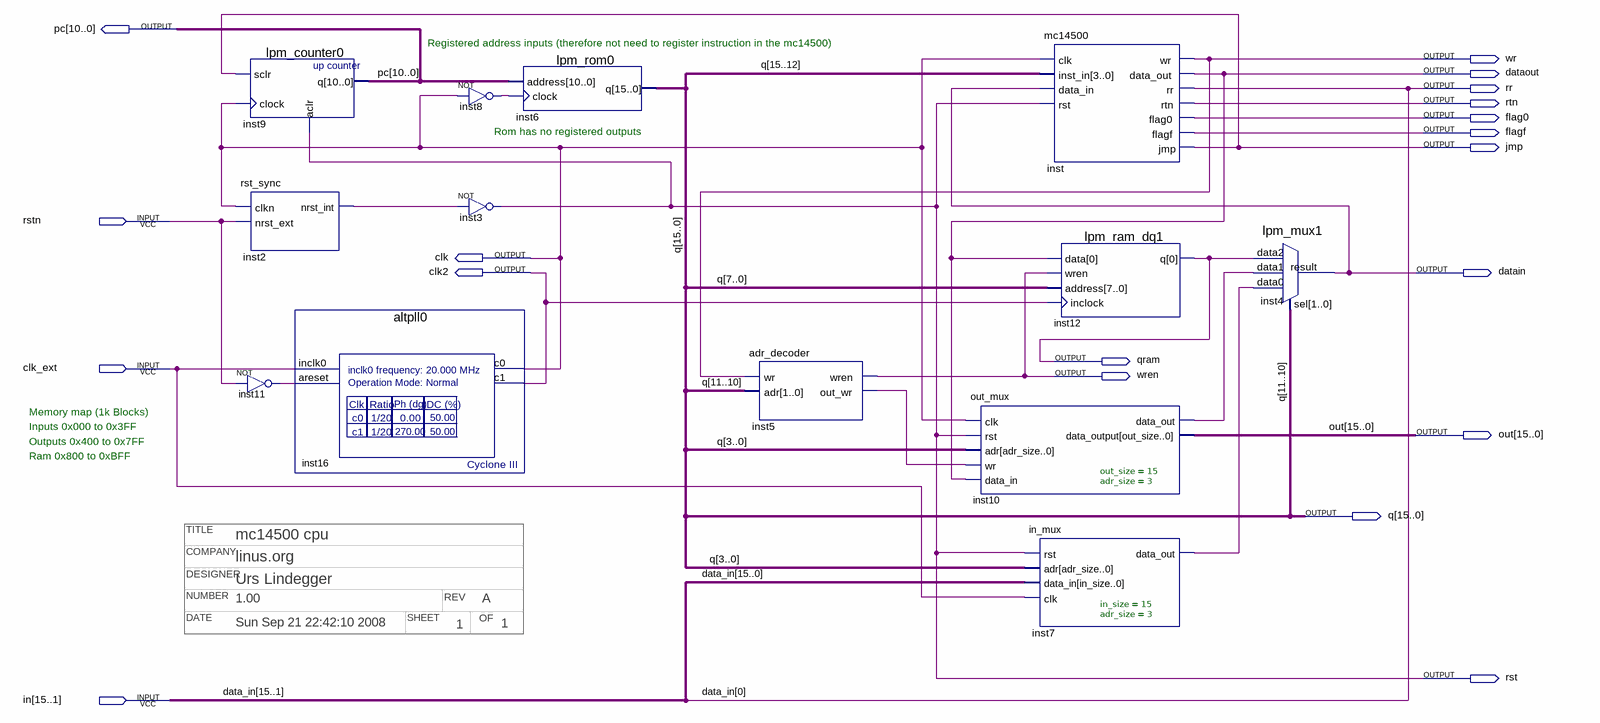
[diagram p0: schematic sheet]
// Quartus schematic mc14500cpu.bdf as structural Verilog: 13 symbols, 19 pins
// Title block: TITLE: mc14500 cpu; COMPANY: linus.org; DESIGNER: Urs Lindegger; NUMBER: 1.00; REV: A; DATE: Sun Sep 21 22:42:10 2008; SHEET: 1; OF: 1
module mc14500cpu (
  input  rstn,
  input  clk_ext,
  input  [15:1] in,
  output [10:0] pc,
  output wr,
  output dataout,
  output rr,
  output rtn,
  output flag0,
  output flagf,
  output jmp,
  output clk,
  output clk2,
  output datain,
  output qram,
  output wren,
  output [15:0] out,
  output [15:0] q,
  output rst
);

  wire inst2_nrst_int, inst5_out_wr, inst7_data_out, inst8_out, inst10_data_out, inst11_out;

  lpm_counter0 inst9 (.sclr(jmp), .clock(clk), .aclr(rst), .q(pc));
  rst_sync inst2 (.clkn(clk), .nrst_ext(rstn), .nrst_int(inst2_nrst_int));
  not inst11 (inst11_out, rstn);
  altpll0 inst16 (.inclk0(clk_ext), .areset(inst11_out), .c0(clk), .c1(clk2));
  not inst8 (inst8_out, clk);
  not inst3 (rst, inst2_nrst_int);
  lpm_rom0 inst6 (.address(pc), .clock(inst8_out), .q(q));
  adr_decoder inst5 (.wr(wr), .adr(q[11:10]), .wren(wren), .out_wr(inst5_out_wr));
  out_mux #(.out_size(15), .adr_size(3)) inst10 (
    .clk(clk), .rst(rst), .adr(q[3:0]), .wr(inst5_out_wr), .data_in(dataout), .data_out(inst10_data_out),
    .data_output(out));
  in_mux #(.in_size(15), .adr_size(3)) inst7 (
    .rst(rst), .adr(q[3:0]), .data_in({in, rr}), .clk(clk_ext), .data_out(inst7_data_out));
  mc14500 inst (
    .clk(clk), .inst_in(q[15:12]), .data_in(datain), .rst(rst), .wr(wr), .data_out(dataout), .rr(rr),
    .rtn(rtn), .flag0(flag0), .flagf(flagf), .jmp(jmp));
  lpm_ram_dq1 inst12 (.data(dataout), .wren(wren), .address(q[7:0]), .inclock(clk2), .q(qram));
  lpm_mux1 inst4 (.data2(qram), .data1(inst10_data_out), .data0(inst7_data_out), .sel(q[11:10]), .result(datain));

  // Other names for the same wires on the sheet: data_in[15:0] = {in, rr}

  // Notes on the sheet:
  //   Registered address inputs (therefore not need to register instruction in the mc14500)
  //   Rom has no registered outputs
  //   Memory map (1k Blocks)
  //   Inputs 0x000 to 0x3FF
  //   Outputs 0x400 to 0x7FF
  //   Ram 0x800 to 0xBFF
endmodule
